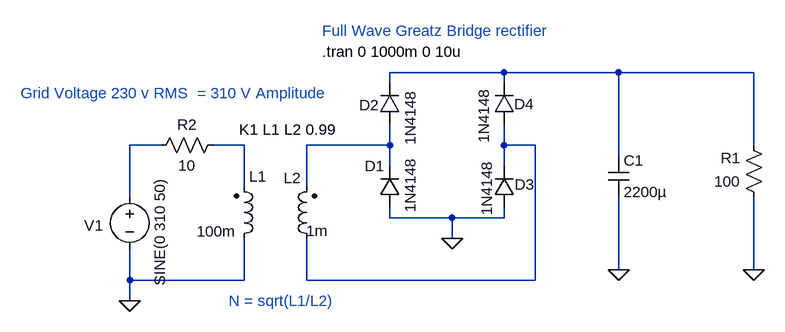
[diagram p0: schematic RealRectifierTrafo.asc]
RealRectifierTrafo.asc, the LTspice schematic file:
Version 4
SHEET 1 880 720
WIRE 192 224 16 224
WIRE 368 224 192 224
WIRE 576 224 368 224
WIRE 16 240 16 224
WIRE 192 240 192 224
WIRE -336 336 -384 336
WIRE -208 336 -256 336
WIRE 16 336 16 304
WIRE 16 336 -112 336
WIRE 192 336 192 304
WIRE 240 336 192 336
WIRE 576 336 576 224
WIRE 368 352 368 224
WIRE 16 368 16 336
WIRE 192 368 192 336
WIRE -208 400 -208 336
WIRE -112 400 -112 336
WIRE -384 416 -384 336
WIRE 16 448 16 432
WIRE 112 448 16 448
WIRE 192 448 192 432
WIRE 192 448 112 448
WIRE 112 480 112 448
WIRE 368 528 368 416
WIRE 576 528 576 416
WIRE -384 544 -384 496
WIRE -208 544 -208 480
WIRE -208 544 -384 544
WIRE -112 544 -112 480
WIRE 240 544 240 336
WIRE 240 544 -112 544
WIRE -384 576 -384 544
FLAG 576 528 0
FLAG 112 480 0
FLAG -384 576 0
FLAG 368 528 0
SYMBOL diode 32 432 R180
WINDOW 0 24 64 Left 2
WINDOW 3 -16 -8 VRight 2
SYMATTR InstName D1
SYMATTR Value 1N4148
SYMBOL voltage -384 400 R0
WINDOW 0 -70 60 Left 2
WINDOW 3 46 -13 VRight 2
WINDOW 123 0 0 Left 2
WINDOW 39 0 0 Left 2
SYMATTR InstName V1
SYMATTR Value SINE(0 310 50)
SYMBOL res 592 432 R180
WINDOW 0 36 76 Left 2
WINDOW 3 36 40 Left 2
SYMATTR InstName R1
SYMATTR Value 100
SYMBOL diode 32 304 R180
WINDOW 0 32 30 Left 2
WINDOW 3 -16 -32 VRight 2
SYMATTR InstName D2
SYMATTR Value 1N4148
SYMBOL diode 176 432 M180
WINDOW 0 32 35 Left 2
WINDOW 3 -11 72 VLeft 2
SYMATTR InstName D3
SYMATTR Value 1N4148
SYMBOL diode 208 304 R180
WINDOW 0 -30 31 Left 2
WINDOW 3 47 -29 VRight 2
SYMATTR InstName D4
SYMATTR Value 1N4148
SYMBOL ind2 -224 496 M180
WINDOW 0 24 112 Left 2
WINDOW 3 -57 27 Left 2
SYMATTR InstName L1
SYMATTR Value 100m
SYMBOL ind2 -96 496 R180
WINDOW 0 24 109 Left 2
WINDOW 3 -17 28 Left 2
SYMATTR InstName L2
SYMATTR Value 1m
SYMBOL res -352 352 R270
WINDOW 0 32 56 VTop 2
WINDOW 3 0 56 VBottom 2
SYMATTR InstName R2
SYMATTR Value 10
SYMBOL cap 352 352 R0
SYMATTR InstName C1
SYMATTR Value 2200µ
TEXT -88 192 Left 2 !.tran 0 1000m 0 10u
TEXT -88 160 Left 2 ;Full Wave Greatz Bridge rectifier
TEXT -216 312 Left 2 !K1 L1 L2 0.99
TEXT -232 576 Left 2 ;N = sqrt(L1/L2)
TEXT -80 256 Right 2 ;Grid Voltage 230 v RMS  = 310 V Amplitude

The netlist it stands for:
* RealRectifierTrafo.asc
D1 0 N004 1N4148
V1 N002 0 SINE(0 310 50)
R1 0 N001 100
D2 N004 N001 1N4148
D3 0 N005 1N4148
D4 N005 N001 1N4148
L1 0 N003 100m
L2 N005 N004 1m
R2 N002 N003 10
C1 N001 0 2200µ
.model D D
.lib standard.dio
.tran 0 1000m 0 10u
* Full Wave Greatz Bridge rectifier
K1 L1 L2 0.99
* N = sqrt(L1/L2)
* Grid Voltage 230 v RMS  = 310 V Amplitude
.backanno
.end